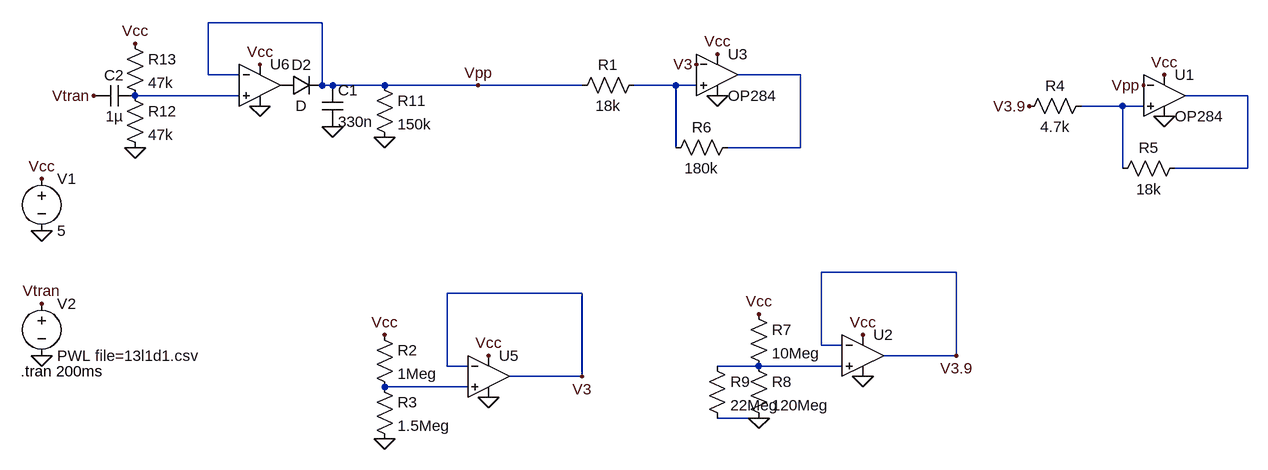
[diagram p0: schematic Transistor test.asc]
Transistor test.asc, the LTspice schematic file:
Version 4.1
SHEET 1 2292 680
WIRE 288 -128 112 -128
WIRE 112 -48 112 -128
WIRE 160 -48 112 -48
WIRE 1024 -48 928 -48
WIRE 288 -32 288 -128
WIRE 304 -32 288 -32
WIRE 384 -32 304 -32
WIRE 528 -32 384 -32
WIRE 688 -32 528 -32
WIRE 832 -32 768 -32
WIRE 864 -32 832 -32
WIRE 160 -16 0 -16
WIRE 1712 -16 1616 -16
WIRE 1520 0 1456 0
WIRE 1552 0 1520 0
WIRE 832 64 832 -32
WIRE 1024 64 1024 -48
WIRE 1024 64 912 64
WIRE 1520 96 1520 0
WIRE 1712 96 1712 -16
WIRE 1712 96 1600 96
WIRE 1264 256 1056 256
WIRE 688 288 480 288
WIRE 1056 368 1056 256
WIRE 1088 368 1056 368
WIRE 1264 384 1264 256
WIRE 1264 384 1152 384
WIRE 480 400 480 288
WIRE 512 400 480 400
WIRE 960 400 896 400
WIRE 1088 400 960 400
WIRE 688 416 688 288
WIRE 688 416 576 416
WIRE 512 432 384 432
WIRE 960 480 896 480
FLAG -144 112 Vcc
FLAG -144 192 0
FLAG -144 384 0
FLAG -144 304 Vtran
FLAG 384 512 0
FLAG 384 352 Vcc
FLAG 544 384 Vcc
FLAG 544 448 0
FLAG 688 416 V3
FLAG -64 -16 Vtran
FLAG 896 -80 Vcc
FLAG 896 -16 0
FLAG 304 32 0
FLAG 384 48 0
FLAG 0 64 0
FLAG 0 -96 Vcc
FLAG 864 -64 V3
FLAG 192 0 0
FLAG 192 -64 Vcc
FLAG 1584 -48 Vcc
FLAG 1584 16 0
FLAG 528 -32 Vpp
FLAG 1552 -32 Vpp
FLAG 960 480 0
FLAG 960 320 Vcc
FLAG 1120 352 Vcc
FLAG 1120 416 0
FLAG 1264 384 V3.9
FLAG 1376 0 V3.9
SYMBOL voltage -144 96 R0
WINDOW 123 0 0 Left 0
WINDOW 39 0 0 Left 0
SYMATTR InstName V1
SYMATTR Value 5
SYMBOL voltage -144 288 R0
WINDOW 123 0 0 Left 0
WINDOW 39 0 0 Left 0
SYMATTR InstName V2
SYMATTR Value PWL file=13l1d1.csv
SYMBOL res 368 336 R0
SYMATTR InstName R2
SYMATTR Value 1Meg
SYMBOL res 368 416 R0
SYMATTR InstName R3
SYMATTR Value 1.5Meg
SYMBOL OpAmps\\UniversalOpAmp 544 416 R0
SYMATTR InstName U5
SYMBOL res 784 -48 R90
WINDOW 0 0 56 VBottom 2
WINDOW 3 32 56 VTop 2
SYMATTR InstName R1
SYMATTR Value 18k
SYMBOL res 928 48 R90
WINDOW 0 0 56 VBottom 2
WINDOW 3 32 56 VTop 2
SYMATTR InstName R6
SYMATTR Value 180k
SYMBOL OpAmps\\OP284 896 -112 R0
SYMATTR InstName U3
SYMBOL diode 224 -16 R270
WINDOW 0 32 32 VTop 2
WINDOW 3 0 32 VBottom 2
SYMATTR InstName D2
SYMBOL cap 288 -32 R0
SYMATTR InstName C1
SYMATTR Value 330n
SYMBOL res 368 -48 R0
SYMATTR InstName R11
SYMATTR Value 150k
SYMBOL cap 0 -32 R90
WINDOW 0 0 32 VBottom 2
WINDOW 3 32 32 VTop 2
SYMATTR InstName C2
SYMATTR Value 1µ
SYMBOL res -16 -32 R0
SYMATTR InstName R12
SYMATTR Value 47k
SYMBOL res -16 -112 R0
SYMATTR InstName R13
SYMATTR Value 47k
SYMBOL OpAmps\\UniversalOpAmp2 192 -32 R0
SYMATTR InstName U6
SYMBOL res 1472 -16 R90
WINDOW 0 0 56 VBottom 2
WINDOW 3 32 56 VTop 2
SYMATTR InstName R4
SYMATTR Value 4.7k
SYMBOL res 1616 80 R90
WINDOW 0 0 56 VBottom 2
WINDOW 3 32 56 VTop 2
SYMATTR InstName R5
SYMATTR Value 18k
SYMBOL OpAmps\\OP284 1584 -80 R0
SYMATTR InstName U1
SYMBOL res 944 304 R0
SYMATTR InstName R7
SYMATTR Value 10Meg
SYMBOL res 944 384 R0
SYMATTR InstName R8
SYMATTR Value 120Meg
SYMBOL OpAmps\\UniversalOpAmp 1120 384 R0
SYMATTR InstName U2
SYMBOL res 880 384 R0
SYMATTR InstName R9
SYMATTR Value 22Meg
TEXT -176 408 Left 2 !.tran 200ms

The netlist it stands for:
* Transistor test.asc
V1 Vcc 0 5
V2 Vtran 0 PWL file=13l1d1.csv
R2 Vcc N007 1Meg
R3 N007 0 1.5Meg
X§U5 N007 V3 Vcc 0 V3 level1 Avol=1Meg GBW=10Meg Vos=0 En=0 Enk=0 In=0 Ink=0 Rin=500Meg  ; pins In+ In- V+ V- OUT
R1 N002 Vpp 18k
R6 N001 N002 180k
X§U3 N002 V3 Vcc 0 N001 OP284  ; pins In+ In- V+ V- OUT
D2 P001 Vpp D
C1 Vpp 0 330n
R11 Vpp 0 150k
C2 N003 Vtran 1µ
R12 N003 0 47k
R13 Vcc N003 47k
X§U6 N003 Vpp Vcc 0 P001 level2 Avol=1Meg GBW=10Meg Slew=10Meg Ilimit=25m Rail=0 Vos=0 En=0 Enk=0 In=0 Ink=0 Rin=500Meg  ; pins In+ In- V+ V- OUT
R4 N005 V3.9 4.7k
R5 N004 N005 18k
X§U1 N005 Vpp Vcc 0 N004 OP284  ; pins In+ In- V+ V- OUT
R7 Vcc N006 10Meg
R8 N006 0 120Meg
X§U2 N006 V3.9 Vcc 0 V3.9 level1 Avol=1Meg GBW=10Meg Vos=0 En=0 Enk=0 In=0 Ink=0 Rin=500Meg  ; pins In+ In- V+ V- OUT
R9 N006 0 22Meg
.model D D
.lib standard.dio
.tran 200ms
.lib UniversalOpAmp1.lib
.lib ADI1.lib
.lib UniversalOpAmp2.lib
.backanno
.end